# Altium schematic sheet Port.SchDoc
size 177 x 165 mm; SheetNumber: 1; SheetTotal: 1
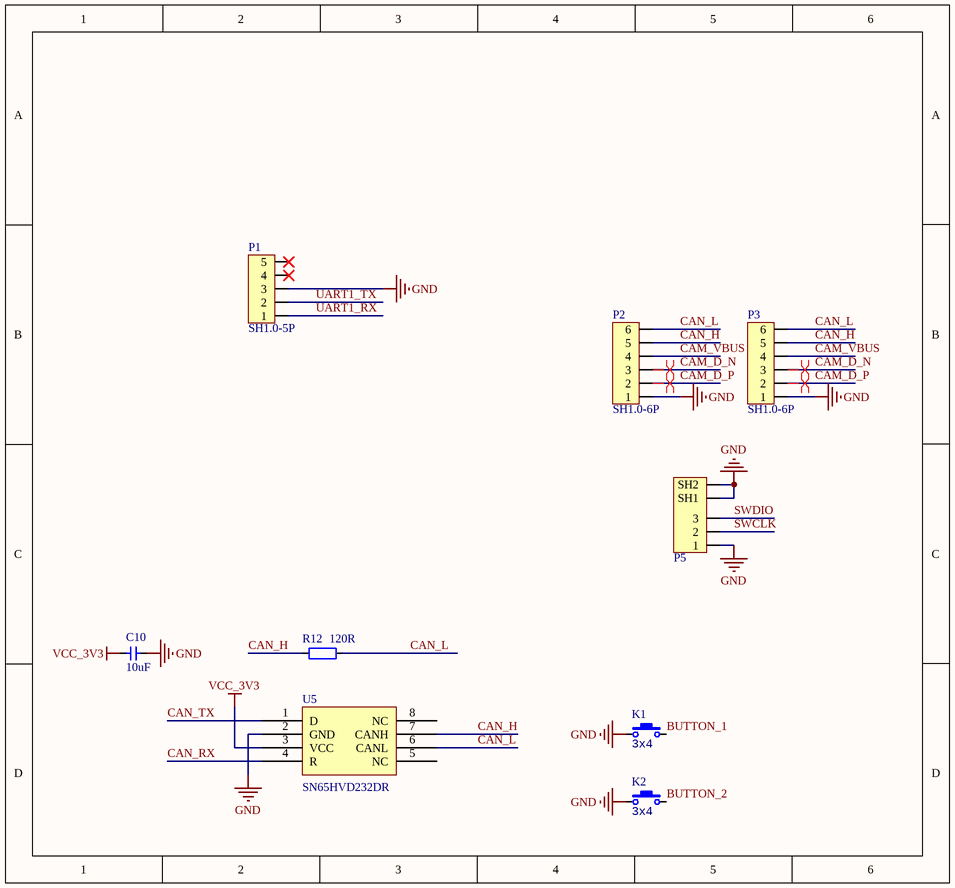
[diagram p0: Port.SchDoc]

## Parts
C10  10uF  [CAP_0402]
K1  value 3x4  [ButtonTACT_3x4x2_180]  (hidden comment: TACT 2P)
K2  value 3x4  [ButtonTACT_3x4x2_180]  (hidden comment: TACT 2P)
P1  SH1.0-5P  [SH1.0-5P]
P2  SH1.0-6P  [SH1.0-6P]
P3  SH1.0-6P  [SH1.0-6P]
P5  SH1.0-3P  [SH1.0-3P]  (value not drawn)
R12  120R  [RES_0402]
U5  Manufacturer Part Number: SN65HVD232DR  [SO-8]  (hidden comment: SN65HVD232D)

## Nets
GND: C10.1 K1.1 K2.1 P1.3 P2.1 P3.1 P5.1 P5.SH1 P5.SH2 U5.2(GND)
VCC_3V3: C10.2 U5.3(VCC)
BUTTON_1: K1.2
BUTTON_2: K2.2
CAM_D_N: P2.3 P3.3
CAM_D_P: P2.2 P3.2
CAM_VBUS: P2.4 P3.4
CAN_H: P2.5 P3.5 R12.1 U5.7(CANH)
CAN_L: P2.6 P3.6 R12.2 U5.6(CANL)
CAN_RX: U5.4(R)
CAN_TX: U5.1(D)
SWCLK: P5.2
SWDIO: P5.3
UART1_RX: P1.1
UART1_TX: P1.2

Not connected (* = marked no-connect by the designer): P1 4* 5*; U5 5(NC) 8(NC)

## Layout directives
differential pair: CAM_D_N, CAM_D_P

## Library data of the parts
C10 = 电容-0402: Capacitor; Value: 0.1u
K1 K2 = ButtonTACT_3x4x2_180: Button; type: TACT 2P
P5 = SH1.0-3P: Header
R12 = 电阻-0402: Resistor; Value: 22R
U5 = SN65HVD232D: Manufacturer: Texas Instruments; Protocol: CAN; Number of Drivers/Receivers: 1/1; Duplex: Half; Data Rate: 1Mbps; Voltage - Supply: 3 V ~ 3.6 V; Supplier 1: Digi-Key; Supplier Part Number 1: 296-26344-2-ND; RoHS: RoHS Compliant; Category: Integrated Circuits (ICs); Stock: 5000; Pricing 1: 2500=0.84375 (USD); Packaging: Tape & Reel (TR); Part Status: Active; Type: Transceiver; Operating Temperature: -40°C ~ 85°C; Mounting Type: Surface Mount; Package / Case: 8-SOIC (0.154", 3.90mm Width); Supplier Device Package: 8-SOIC; ComponentLink1URL: http://www.ti.com/lit/ds/symlink/sn65hvd230.pdf; ComponentLink1Description: http://www.ti.com/lit/ds/symlink/sn65hvd230.pdf; Supplier 2: Digi-Key; Supplier Part Number 2: 296-26344-1-ND; Pricing 2: 1=2.05, 10=1.842, 100=1.4809, 500=1.21668, 1000=1.00811 (USD)